# Altium project auto.PrjPcb
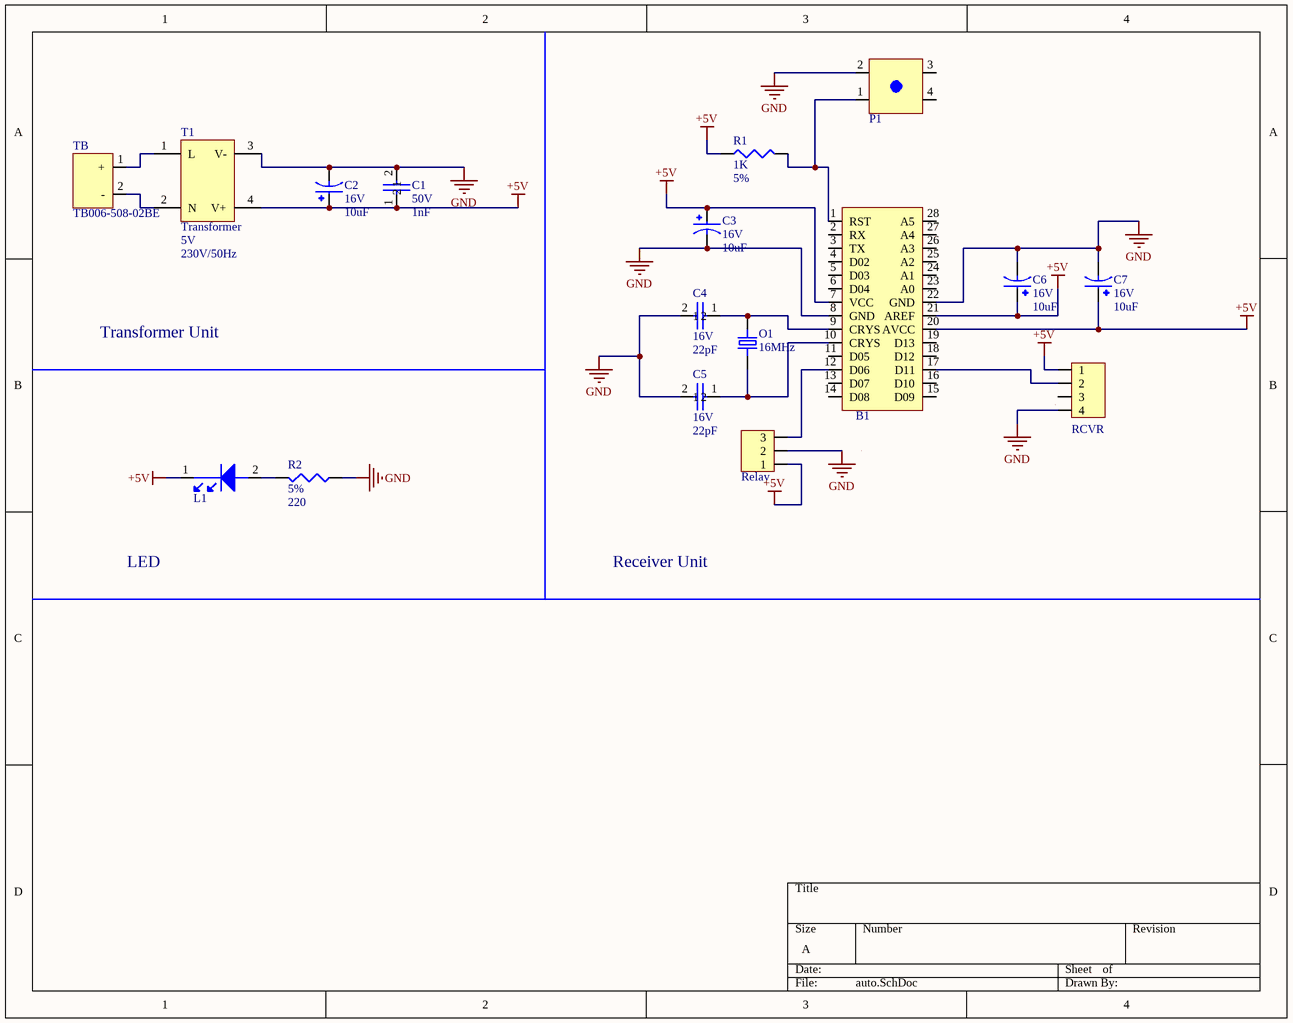
[diagram p0: auto.SchDoc]
1 sheet, 17 parts. Net scope: global (net labels, ports and power ports of the same name join across sheets).
Board file: auto.PcbDoc

## Sheet auto.SchDoc
size A; SheetNumber: 1; SheetTotal: 1

### Parts
B1  1-2199298-8  [FP-1-2199298-9-MFG]  (value not drawn)
C1  Voltage: 50V  Capacitance: 1nF  [10uF_Capacitor]  (hidden comment: K102K15X7RF5TL2)
C2  Voltage: 16V  Capacitance: 10uF  [10uF_Capacitor]  (hidden comment: EEA-GA1C100)
C3  Voltage: 16V  Capacitance: 10uF  [10uF_Capacitor]  (hidden comment: EEA-GA1C100)
C4  Voltage: 16V  Capacitance: 22pF  [10uF_Capacitor]  (hidden comment: S220K25SL0N63L6R)
C5  Voltage: 16V  Capacitance: 22pF  [10uF_Capacitor]  (hidden comment: S220K25SL0N63L6R)
C6  Voltage: 16V  Capacitance: 10uF  [10uF_Capacitor]  (hidden comment: EEA-GA1C100)
C7  Voltage: 16V  Capacitance: 10uF  [10uF_Capacitor]  (hidden comment: EEA-GA1C100)
L1  WP7113SRD/J4  [LEDRD254W57D500H1070]  (value not drawn)
O1  value 16MHz  [Oscillator]  (hidden comment: ECS-160-20-4_1)
P1  COM-00097  [P_button]  (value not drawn)
R1  Resistance: 1K  Tolerance: 5%  [Resister]  (hidden comment: CFM12JT1K00)
R2  Tolerance: 5%  Resistance: 220  [Resister]  (hidden comment: CFM12JT220R)
RCVR  61300411121  [61300411121]  (value not drawn)
Relay  61300311121  [Female]  (value not drawn)
T1  Transformer  Output Voltage: 5V  Input Volatge: 230V/50Hz  [Hilink]
TB  TB006-508-02BE  [terminalbox]

### Nets
+5V: B1.7(VCC) B1.20(AVCC) B1.21(AREF) C1.1 C2.1 C3.1 C6.1 C7.1 L1.1 R1.1 RCVR.1 Relay.1 T1.4(V+)
GND: B1.8(GND) B1.22(GND) C1.2 C2.2 C3.2 C4.2 C5.2 C6.2 C7.2 P1.2 R2.2 RCVR.4 Relay.2 T1.3(V-)
NetB1_1: B1.1(RST) P1.1 R1.2
NetB1_9: B1.9(CRYS) C4.1 O1.1
NetB1_10: B1.10(CRYS) C5.1 O1.2
NetB1_12: B1.12(D06) Relay.3
NetB1_17: B1.17(D11) RCVR.2
NetL1_2: L1.2 R2.1
NetT1_1: T1.1(L) TB.1(+)
NetT1_2: T1.2(N) TB.2(-)

Not connected (* = marked no-connect by the designer): B1 2(RX) 3(TX) 4(D02) 5(D03) 6(D04) 11(D05) 13(D07) 14(D08) 15(D09) 16(D10) 18(D12) 19(D13) 23(A0) 24(A1) 25(A2) 26(A3) 27(A4) 28(A5); P1 3 4; RCVR 3

### Notes on the sheet
- Transformer Unit
- LED
- Receiver Unit

### Library data of the parts
B1 = 1-2199298-8: IC Socket; Manufacturer: TE Connectivity; Supplier: Mouser; Supplier Part Number: 571-1-2199298-8; Manufacturer Part Number: 1-2199298-8; RoHS: Yes; Category: IC and Component Sockets; Stock: 5353; Pricing: 1=0.39, 10=0.379, 50=0.379, 100=0.379, 1000=0.379, 10000=0.307 (USD); Contact Material: Bronze; Contact Finish - Mating: TIN; Device Socket Type: IC SOCKET; Manufacturer Series: 2199298; Reach SVHC Compliant: Yes; RoHS Compliant: Yes; ComponentLink1URL: https://www.te.com:443/usa-en/product-1-2199298-8.datasheet.pdf?src-supplier=IHS+Markit; ComponentLink1Description: https://www.te.com:443/usa-en/product-1-2199298-8.datasheet.pdf?src-supplier=IHS+Markit; ComponentLink2URL: http://www.alliedelec.com/m/d/1cf61418f54f295ea6d222d573753863.pdf?src-supplier=Allied+Electronics; ComponentLink2Description: http://www.alliedelec.com/m/d/1cf61418f54f295ea6d222d573753863.pdf?src-supplier=Allied+Electronics; ComponentLink3URL: https://www.te.com/commerce/DocumentDelivery/DDEController?Action=srchrtrv&amp;DocNm=2199298&amp;DocType=Customer+Drawing&amp;DocLang=English&src-supplier=Digi-Key; ComponentLink3Description: https://www.te.com/commerce/DocumentDelivery/DDEController?Action=srchrtrv&amp;DocNm=2199298&amp;DocType=Customer+Drawing&amp;DocLang=English&src-supplier=Digi-Key; ComponentLink4URL: http://www.te.com/commerce/DocumentDelivery/DDEController?Action=showdoc&DocId=Customer+Drawing%7F2199298%7FA%7Fpdf%7FEnglish%7FENG_CD_2199298_A_baseFilename.pdf&src-supplier=Avnet; ComponentLink4Description: http://www.te.com/commerce/DocumentDelivery/DDEController?Action=showdoc&DocId=Customer+Drawing%7F2199298%7FA%7Fpdf%7FEnglish%7FENG_CD_2199298_A_baseFilename.pdf&src-supplier=Avnet
C1 = K102K15X7RF5TL2: Ceramic Capacitor, Multilayer, Ceramic, 50V, 10% +Tol, 10% -Tol, X7R, 15% TC, 0.001uF, Through Hole Mount; Manufacturer: Vishay BCcomponents; Value: 1nF; Multilayer: Yes; Supplier: Mouser; Supplier Part Number: 594-K102K15X7RF5TL2; Manufacturer Part Number: K102K15X7RF5TL2; RoHS: Yes; Category: Ceramic Capacitors; Stock: 24201; Pricing: 1=0.23, 10=0.104, 50=0.104, 100=0.06, 1000=0.053, 10000=0.041 (USD); Mounting Technology: Through Hole; Pins: 2; Dielectric Material: Ceramic; Package Shape: Rectangular; Terminal Finish: Tin; Min Operating Temperature: -55°C; Max Operating Temperature: 125°C; JESD-609 Code: e3; Capacitor Type: Ceramic; Tolerance  (fill in as +-): 10%; Package Style: RadialMeter; Packaging: Tape and Reel; Tolerance (fill in as +-): 10%; Rated DC Voltage (URdc): 50V; Temperature Characteristics Code: X7R; Termination: Wire; Length: 4mm; Width: 2.5mm; Height: 5.58mm; Terminal Pitch: 2.5mm; Reach SVHC Compliant: Yes; RoHS Compliant: Yes; ComponentLink1URL: https://datasheet.ciiva.com:443/pdfs/VipMasterIC/IC/VISH/VISHS88539/VISHS88539-1.pdf?src-supplier=IHS+Markit; ComponentLink1Description: https://datasheet.ciiva.com:443/pdfs/VipMasterIC/IC/VISH/VISHS88539/VISHS88539-1.pdf?src-supplier=IHS+Markit; ComponentLink2URL: https://datasheet.ciiva.com/145/kseries-145600.pdf?src-supplier=Digi-Key; ComponentLink2Description: https://datasheet.ciiva.com/145/kseries-145600.pdf?src-supplier=Digi-Key; ComponentLink3URL: https://datasheet.ciiva.com/18442/70121924-18442616.pdf?src-supplier=Allied+Electronics; ComponentLink3Description: https://datasheet.ciiva.com/18442/70121924-18442616.pdf?src-supplier=Allied+Electronics; ComponentLink4URL: https://datasheet.ciiva.com/46394/1756139-46394540.pdf?src-supplier=Element14; ComponentLink4Description: https://datasheet.ciiva.com/46394/1756139-46394540.pdf?src-supplier=Element14; ComponentLink5URL: https://datasheet.ciiva.com/7974/1682830-7974760.pdf?src-supplier=Element14; ComponentLink5Description: https://datasheet.ciiva.com/7974/1682830-7974760.pdf?src-supplier=Element14; ComponentLink6URL: https://datasheet.ciiva.com/145/kseries-145599.pdf?src-supplier=Digi-Key; ComponentLink6Description: https://datasheet.ciiva.com/145/kseries-145599.pdf?src-supplier=Digi-Key
C2 C3 C6 C7 = EEA-GA1C100: Aluminum Electrolytic Capacitor, Polarized, Aluminum (wet), 16V, 20% +Tol, 20% -Tol, 10uF, Through Hole Mount; Manufacturer: Panasonic; Manufacturer Series: GA; Dielectric Material: Aluminium; Leakage Current: 3uA; Ripple Current: 30mA; Tan Delta: 0.18; Supplier: Mouser; Supplier Part Number: 667-EEA-GA1C100; Manufacturer Part Number: EEA-GA1C100; RoHS: Yes; Category: Aluminum Electrolytic Capacitors; Stock: 3224; Pricing: 1=0.32, 10=0.216, 50=0.144, 100=0.123, 1000=0.086, 10000=0.086 (USD); Mounting Technology: Through Hole; Pins: 2; Package Shape: Cylindrical; Terminal Finish: Tin; Min Operating Temperature: -55°C; Max Operating Temperature: 105°C; JESD-609 Code: e3; Polarity: Polarized; Capacitor Type: Aluminium; Tolerance  (fill in as +-): 20%; Package Style: RadialMeter; Packaging: Bulk; Tolerance (fill in as +-): 20%; Rated DC Voltage (URdc): 16V; Series: EEA-GA; Termination: Wire; Diameter: 4mm; Length: 7mm; Terminal Pitch: 1.5mm; Reach SVHC Compliant: Yes; RoHS Compliant: Yes; ComponentLink1URL: https://datasheet.ciiva.com:443/pdfs/VipMasterIC/IC/PANA/PANA-S-A0007980152/PANA-S-A0007980152-1.pdf?src-supplier=IHS+Markit; ComponentLink1Description: https://datasheet.ciiva.com:443/pdfs/VipMasterIC/IC/PANA/PANA-S-A0007980152/PANA-S-A0007980152-1.pdf?src-supplier=IHS+Markit; ComponentLink2URL: https://datasheet.ciiva.com/11783/0900766b800bd184-11783675.pdf?src-supplier=Rs; ComponentLink2Description: https://datasheet.ciiva.com/11783/0900766b800bd184-11783675.pdf?src-supplier=Rs; ComponentLink3URL: https://datasheet.ciiva.com/30132/61aba0000ce99-30132280.pdf?src-supplier=Onlinecomponents.com; ComponentLink3Description: https://datasheet.ciiva.com/30132/61aba0000ce99-30132280.pdf?src-supplier=Onlinecomponents.com; ComponentLink4URL: https://datasheet.ciiva.com/2984/aba0000ce99-2984970.pdf?src-supplier=Avnet; ComponentLink4Description: https://datasheet.ciiva.com/2984/aba0000ce99-2984970.pdf?src-supplier=Avnet; ComponentLink5URL: https://datasheet.ciiva.com/14606/70256146-14606495.pdf?src-supplier=Allied+Electronics; ComponentLink5Description: https://datasheet.ciiva.com/14606/70256146-14606495.pdf?src-supplier=Allied+Electronics; ComponentLink6URL: https://datasheet.ciiva.com/43461/1521263-43461069.pdf?src-supplier=Farnell; ComponentLink6Description: https://datasheet.ciiva.com/43461/1521263-43461069.pdf?src-supplier=Farnell; ComponentLink7URL: https://datasheet.ciiva.com/24024/aba0000ce99-48764-24024622.pdf?src-supplier=Mouser; ComponentLink7Description: https://datasheet.ciiva.com/24024/aba0000ce99-48764-24024622.pdf?src-supplier=Mouser
C4 C5 = S220K25SL0N63L6R: Ceramic Capacitor, Ceramic, 1000V, 10% +Tol, 10% -Tol, SL0, 120ppm/Cel TC, 0.000022uF, Through Hole Mount; Manufacturer: Vishay BCcomponents; Supplier: Mouser; Supplier Part Number: 594-S220K25SL0N63L6R; Manufacturer Part Number: S220K25SL0N63L6R; RoHS: Yes; Category: Ceramic Capacitors; Stock: 23582; Pricing: 1=0.4, 10=0.197, 50=0.197, 100=0.169, 1000=0.107, 10000=0.095 (USD); Pins: 2; Dielectric Material: Ceramic; Capacitor Type: Ceramic; RoHS Compliant: Yes; ComponentLink1URL: https://datasheet.ciiva.com:443/pdfs/VipMasterIC/IC/VISH/VISH-S-A0003941534/VISH-S-A0003941534-1.pdf?src-supplier=IHS+Markit; ComponentLink1Description: https://datasheet.ciiva.com:443/pdfs/VipMasterIC/IC/VISH/VISH-S-A0003941534/VISH-S-A0003941534-1.pdf?src-supplier=IHS+Markit; ComponentLink2URL: https://datasheet.ciiva.com/148/geninfo-cd-rfi-safcaps-148963.pdf?src-supplier=Digi-Key; ComponentLink2Description: https://datasheet.ciiva.com/148/geninfo-cd-rfi-safcaps-148963.pdf?src-supplier=Digi-Key; ComponentLink3URL: https://datasheet.ciiva.com/7974/gapkap-7974888.pdf?src-supplier=Element14; ComponentLink3Description: https://datasheet.ciiva.com/7974/gapkap-7974888.pdf?src-supplier=Element14
L1 = WP7113SRD/J4: LED Uni-Color SB. Red 660nm 2-Pin T-1 3/4 Bulk; Manufacturer: Kingbright; Supplier: Digi-Key; Supplier Part Number: 754-2139-ND; Manufacturer Part Number: WP7113SRD/J4; RoHS: No; Category: LEDs; Stock: 14375; Pricing: 1=0.69, 10=0.448, 100=0.2936, 1000=0.23175, 2000=0.2163, 5000=0.20858, 10000=0.20549, 25000=0.20085 (USD); ComponentLink1URL: http://www.kingbrightusa.com/images/catalog/SPEC/WP7113SRD-J4.pdf?src-supplier=Digi-Key; ComponentLink1Description: http://www.kingbrightusa.com/images/catalog/SPEC/WP7113SRD-J4.pdf?src-supplier=Digi-Key
P1 = COM-00097: CONN HEADER SMD 28POS 0.8MM; Manufacturer: SparkFun; Supplier: Digi-Key; Supplier Part Number: 1568-COM-00097-ND; Manufacturer Part Number: COM-00097; RoHS: No; Category: Tactile Switches; Pricing: 1=0.45 (USD)
R1 = CFM12JT1K00: Fixed Resistor, Carbon Film, 0.5W, 1000ohm, 350V, 5% +/-Tol, -400,0ppm/Cel, Through Hole Mount; Manufacturer: Stackpole Electronics; Power: 500mW; Rated Temperature: 70°C; Value: 1kR; Temperature Coefficient: 400ppm/°C; Lead Diameter: 0.55mm; Lead Length: 28mm; Package Diameter: 2.3mm; Package Length: 6mm; Supplier: Digi-Key; Supplier Part Number: S1KHCT-ND; Manufacturer Part Number: CFM12JT1K00; RoHS: Yes; Category: Through-Hole Resistors; Stock: 145304; Pricing: 1=0.1, 10=0.067, 25=0.0488, 50=0.0372, 100=0.0274, 250=0.02092, 500=0.01672, 1000=0.01231 (USD); Mounting Technology: Through Hole; Pins: 2; Package Shape: Tubular; Terminal Finish: Tin; Min Operating Temperature: -55°C; Max Operating Temperature: 155°C; Resistor Type: FIXED RESISTOR; Construction: Tubular; Package Style: AxialMeter; Packaging: Tape and Reel; Technology: CARBON FILM; Termination: Wire; Working Voltage: 350V; JESD-609 Code: e3; Reach SVHC Compliant: Yes; RoHS Compliant: Yes; ComponentLink1URL: https://datasheet.ciiva.com:443/pdfs/VipMasterIC/IC/SEIE/SEIE-S-A0009883960/SEIE-S-A0009883960-1.pdf?src-supplier=IHS+Markit; ComponentLink1Description: https://datasheet.ciiva.com:443/pdfs/VipMasterIC/IC/SEIE/SEIE-S-A0009883960/SEIE-S-A0009883960-1.pdf?src-supplier=IHS+Markit; ComponentLink2URL: http://components.arrow.com/part/dataview/51859118S46073N1174?src-supplier=Arrow+Electronics; ComponentLink2Description: http://components.arrow.com/part/dataview/51859118S46073N1174?src-supplier=Arrow+Electronics; ComponentLink3URL: https://www.seielect.com/Catalog/SEI-CF_CFM.pdf?src-supplier=Digi-Key; ComponentLink3Description: https://www.seielect.com/Catalog/SEI-CF_CFM.pdf?src-supplier=Digi-Key; ComponentLink4URL: https://www.seielect.com/catalog/SEI-Packaging.pdf?src-supplier=Digi-Key; ComponentLink4Description: https://www.seielect.com/catalog/SEI-Packaging.pdf?src-supplier=Digi-Key; ComponentLink5URL: https://www.seielect.com/catalog/SEI-CF_CFM.pdf?src-supplier=Avnet; ComponentLink5Description: https://www.seielect.com/catalog/SEI-CF_CFM.pdf?src-supplier=Avnet; ComponentLink6URL: https://www.verical.com/server-webapp/html/getDatasheet?partID=470997&src-supplier=Verical; ComponentLink6Description: https://www.verical.com/server-webapp/html/getDatasheet?partID=470997&src-supplier=Verical
R2 = CFM12JT220R: Fixed Resistor, Carbon Film, 0.5W, 220ohm, 350V, 5% +/-Tol, -400,0ppm/Cel, Through Hole Mount; Manufacturer: Stackpole Electronics; Power: 500mW; Rated Temperature: 70°C; Value: 220R; Temperature Coefficient: 400ppm/°C; Lead Diameter: 0.55mm; Lead Length: 28mm; Package Diameter: 2.3mm; Package Length: 6mm; Supplier: Digi-Key; Supplier Part Number: S220HTR-ND; Manufacturer Part Number: CFM12JT220R; RoHS: Yes; Category: Through-Hole Resistors; Stock: 15000; Pricing: 5000=0.00883, 10000=0.00767, 25000=0.00674, 50000=0.00618, 125000=0.00605 (USD); Mounting Technology: Through Hole; Pins: 2; Package Shape: Tubular; Terminal Finish: Tin; Min Operating Temperature: -55°C; Max Operating Temperature: 155°C; Resistor Type: FIXED RESISTOR; Construction: Tubular; Package Style: AxialMeter; Packaging: Tape and Reel; Technology: CARBON FILM; Termination: Wire; Working Voltage: 350V; JESD-609 Code: e3; Reach SVHC Compliant: Yes; RoHS Compliant: Yes; ComponentLink1URL: https://datasheet.ciiva.com:443/pdfs/VipMasterIC/IC/SEIE/SEIE-S-A0009883960/SEIE-S-A0009883960-1.pdf?src-supplier=IHS+Markit; ComponentLink1Description: https://datasheet.ciiva.com:443/pdfs/VipMasterIC/IC/SEIE/SEIE-S-A0009883960/SEIE-S-A0009883960-1.pdf?src-supplier=IHS+Markit; ComponentLink2URL: https://www.seielect.com/catalog/SEI-CF_CFM.pdf?src-supplier=Avnet; ComponentLink2Description: https://www.seielect.com/catalog/SEI-CF_CFM.pdf?src-supplier=Avnet; ComponentLink3URL: https://www.seielect.com/Catalog/SEI-CF_CFM.pdf?src-supplier=Digi-Key; ComponentLink3Description: https://www.seielect.com/Catalog/SEI-CF_CFM.pdf?src-supplier=Digi-Key; Toleranc: *
RCVR = 61300411121: Board Connector, 4 Contact(s), 1 Row(s), Male, Straight, 0.1 inch Pitch, Solder Terminal, Locking, Black Insulator, Plug; Manufacturer: Wurth Electronics; Contact Pattern: RECTANGULAR; Contact Resistance: 20mR; Contact Style: SQ PIN-SKT; Dielectric Withstanding Voltage (AC): 500V; Insulation Resistance: 1GR; Number Of Connectors: 1; Rated Current (Signal): 3A; Number of Contacts: 4; Body Length: 0.4inch; Reference Standard: UL; Reliability: COMMERCIAL; Supplier: Digi-Key; Supplier Part Number: 732-5317-ND; Manufacturer Part Number: 61300411121; RoHS: Yes; Category: Headers and Wire Housings; Stock: 103058; Pricing: 1=0.19, 10=0.163, 25=0.1352, 50=0.113, 100=0.102, 1000=0.094 (USD); Mounting Technology: Board; Contact Material: Copper Alloy; Contact Finish - Mating: GOLD; Contact Finish - Termination: Gold (Au) - with Nickel (Ni) barrier; Insulation Color: Black; Insulation Material: Polybutylene; Min Operating Temperature: -40°C; Max Operating Temperature: 125°C; Connector Type: BOARD CONNECTOR; JESD-609 Code: e4; Body/Shell Style: PLUG; Contact Gender: Male; Mounting Style: STRAIGHT; Number of Rows Loaded: 1; PCB Contact Pattern: RECTANGULAR; Termination: Solder; Body Breadth: 0.1inch; Body Depth: 0.1inch; Mating Contact Pitch: 0.1inch; Mounting Option 1: LOCKING; Terminal Length: 0.118inch; Terminal Pitch: 2.54mm; Reach SVHC Compliant: Yes; RoHS Compliant: Yes; ComponentLink1URL: https://datasheet.ciiva.com:443/pdfs/VipMasterIC/IC/MIDC/MIDCS07676/MIDCS07676-1.pdf?src-supplier=IHS+Markit; ComponentLink1Description: https://datasheet.ciiva.com:443/pdfs/VipMasterIC/IC/MIDC/MIDCS07676/MIDCS07676-1.pdf?src-supplier=IHS+Markit; ComponentLink2URL: http://www.farnell.com/cad/1737268.pdf?src-supplier=Element14; ComponentLink2Description: http://www.farnell.com/cad/1737268.pdf?src-supplier=Element14; ComponentLink3URL: https://katalog.we-online.de/em/datasheet/6130xx11121.pdf?src-supplier=Digi-Key; ComponentLink3Description: https://katalog.we-online.de/em/datasheet/6130xx11121.pdf?src-supplier=Digi-Key
Relay = 61300311121: Board Connector, 3 Contact(s), 1 Row(s), Male, Straight, 0.1 inch Pitch, Solder Terminal, Locking, Black Insulator, Plug; Manufacturer: Wurth Electronics; Contact Pattern: RECTANGULAR; Contact Resistance: 20mR; Contact Style: SQ PIN-SKT; Dielectric Withstanding Voltage (AC): 500V; Insulation Resistance: 1GR; Number Of Connectors: 1; Rated Current (Signal): 3A; Number of Contacts: 3; Body Length: 0.3inch; Reference Standard: UL; Reliability: COMMERCIAL; Supplier: Digi-Key; Supplier Part Number: 732-5316-ND; Manufacturer Part Number: 61300311121; RoHS: Yes; Category: Uncategorized; Stock: 184286; Pricing: 1=0.13, 10=0.113, 25=0.094, 50=0.079, 100=0.071, 1000=0.066 (USD); Mounting Technology: Board; Contact Material: Copper Alloy; Contact Finish - Mating: GOLD; Contact Finish - Termination: Gold (Au) - with Nickel (Ni) barrier; Insulation Color: Black; Insulation Material: Polybutylene; Min Operating Temperature: -40°C; Max Operating Temperature: 125°C; Connector Type: BOARD CONNECTOR; JESD-609 Code: e4; Body/Shell Style: PLUG; Contact Gender: Male; Mounting Style: STRAIGHT; Number of Rows Loaded: 1; PCB Contact Pattern: RECTANGULAR; Termination: Solder; Body Breadth: 0.1inch; Body Depth: 0.1inch; Mating Contact Pitch: 0.1inch; Mounting Option 1: LOCKING; Terminal Length: 0.118inch; Terminal Pitch: 2.54mm; Reach SVHC Compliant: Yes; RoHS Compliant: Yes; ComponentLink1URL: https://datasheet.ciiva.com:443/pdfs/VipMasterIC/IC/MIDC/MIDCS07676/MIDCS07676-1.pdf?src-supplier=IHS+Markit; ComponentLink1Description: https://datasheet.ciiva.com:443/pdfs/VipMasterIC/IC/MIDC/MIDCS07676/MIDCS07676-1.pdf?src-supplier=IHS+Markit; ComponentLink2URL: http://www.farnell.com/cad/1737268.pdf?src-supplier=Element14; ComponentLink2Description: http://www.farnell.com/cad/1737268.pdf?src-supplier=Element14; ComponentLink3URL: https://katalog.we-online.de/em/datasheet/6130xx11121.pdf?src-supplier=Digi-Key; ComponentLink3Description: https://katalog.we-online.de/em/datasheet/6130xx11121.pdf?src-supplier=Digi-Key
T1 = Transformer: 5V 0.6A 90VAC~265VAC 120V~350V 3W AC-DC 73% Plugin Power Modules ROHS
TB = TB006-508-02BE: Barrier Strip Terminal Block; Manufacturer: CUI Devices; Supplier: Mouser; Supplier Part Number: 490-TB006-508-02BE; Manufacturer Part Number: TB006-508-02BE; RoHS: Yes; Stock: 47338; Pricing: 1=0.86, 10=0.315, 50=0.315, 100=0.301, 1000=0.21, 10000=0.175 (USD)
O1 = ECS-160-20-4_1: Package: None; Price: None; MP: ECS-160-20-4; Availability: Unavailable; Parameter 1: *